# EAGLE design tiller (EAGLE 9.6.2)
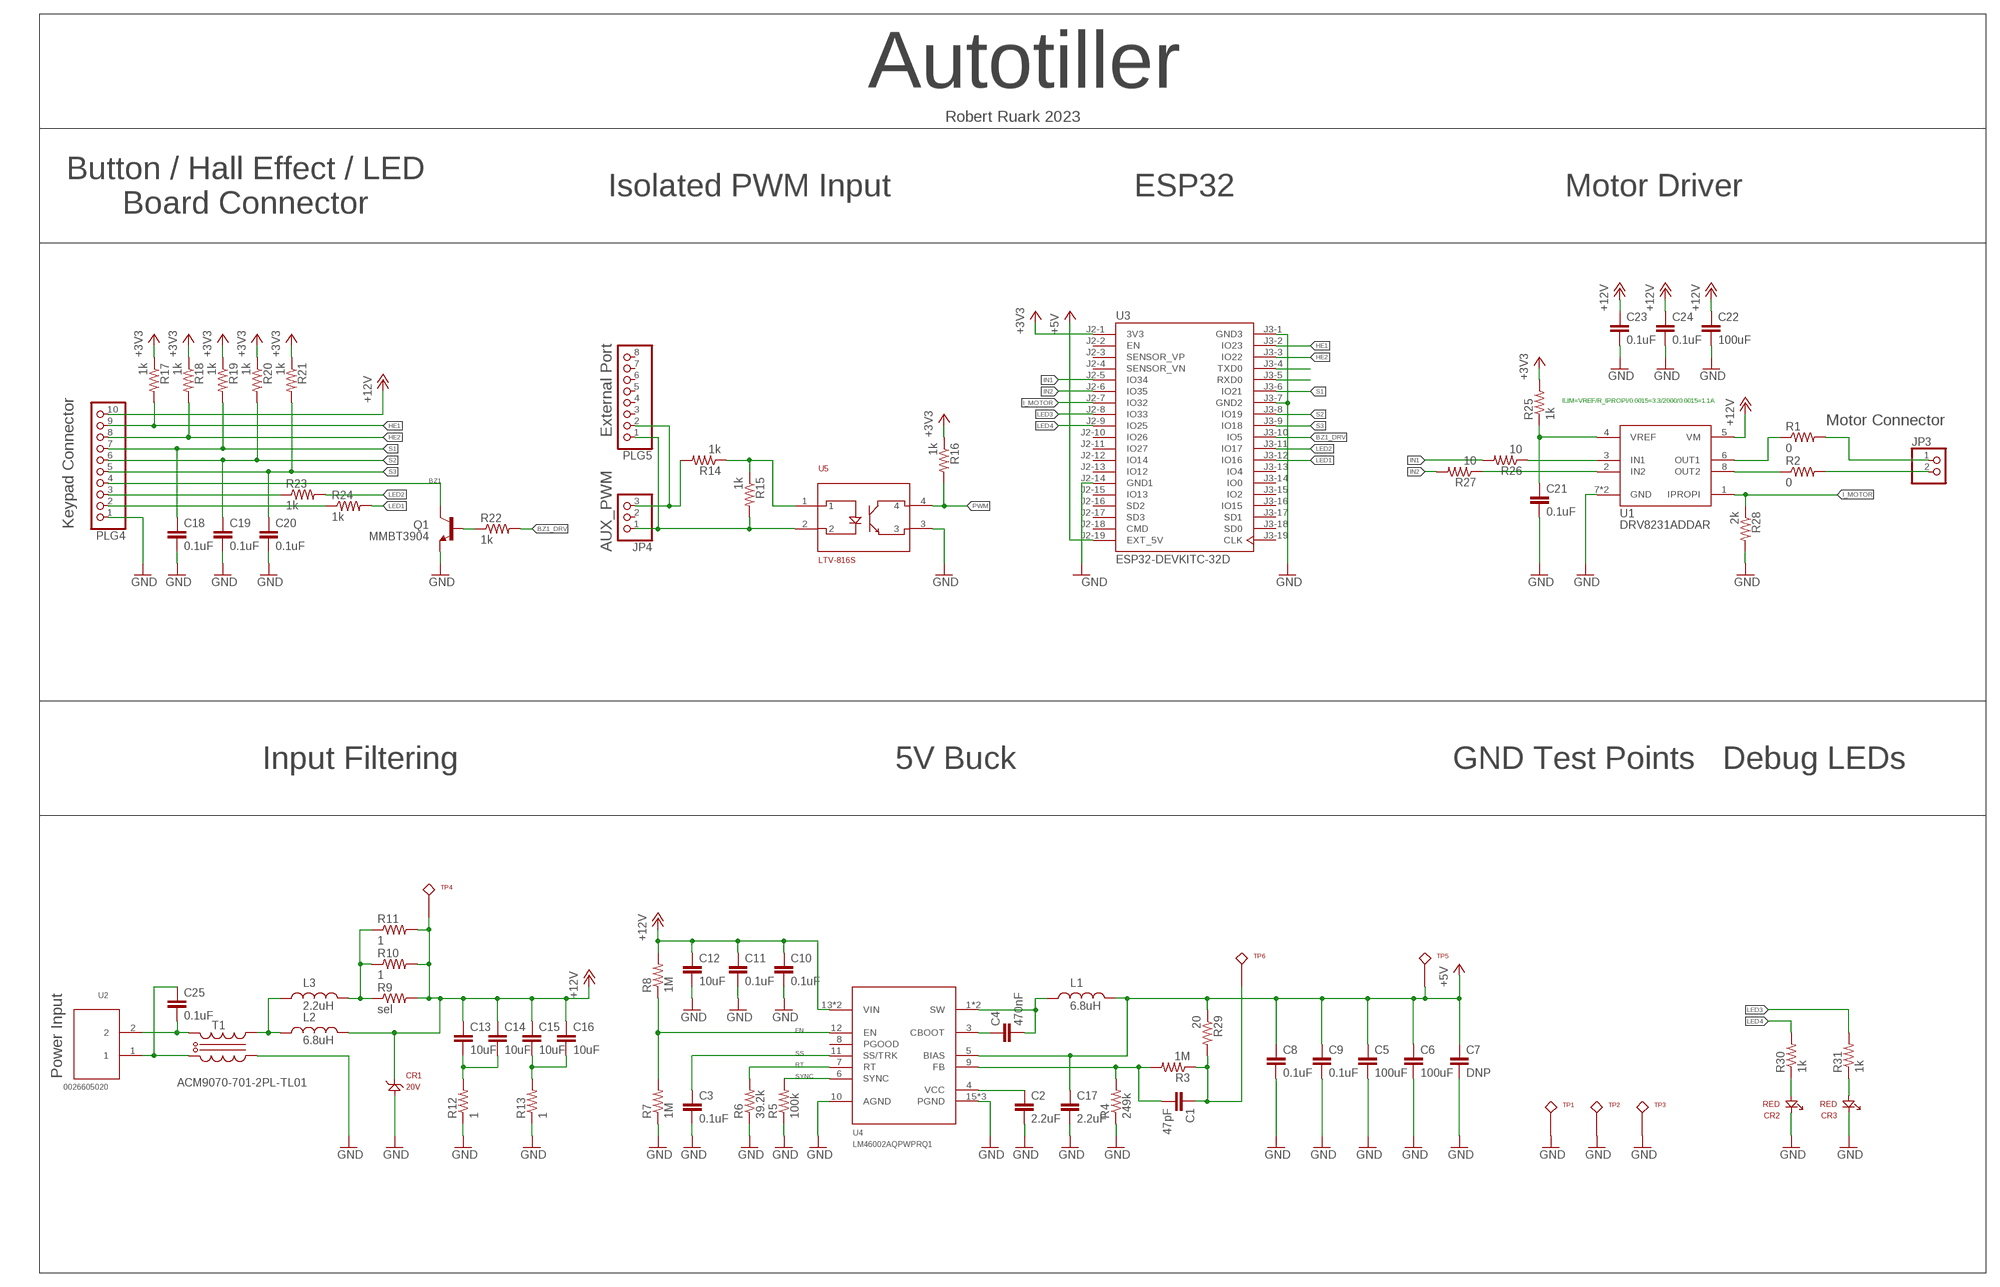
[diagram p0: schematic, sheet 1]

## Parts
C1  47pF  0603_CAPACITOR  [0603]
C2  2.2uF  0805_CAPACITOR  [0805]
C3  0.1uF  0603_CAPACITOR  [0603]
C4  470nF  0805_CAPACITOR  [0805]
C5  100uF  1210_CAPACITOR  [1210]
C6  100uF  1210_CAPACITOR  [1210]
C7  DNP  1210_CAPACITOR  [1210]
C8  0.1uF  0603_CAPACITOR  [0603]
C9  0.1uF  0603_CAPACITOR  [0603]
C10  0.1uF  0603_CAPACITOR  [0603]
C11  0.1uF  0603_CAPACITOR  [0603]
C12  10uF  1210_CAPACITOR  [1210]
C13  10uF  1210_CAPACITOR  [1210]
C14  10uF  1210_CAPACITOR  [1210]
C15  10uF  1210_CAPACITOR  [1210]
C16  10uF  1210_CAPACITOR  [1210]
C17  2.2uF  0805_CAPACITOR  [0805]
C18  0.1uF  0603_CAPACITOR  [0603]
C19  0.1uF  0603_CAPACITOR  [0603]
C20  0.1uF  0603_CAPACITOR  [0603]
C21  0.1uF  0603_CAPACITOR  [0603]
C22  100uF  1210_CAPACITOR  [1210]
C23  0.1uF  0603_CAPACITOR  [0603]
C24  0.1uF  0603_CAPACITOR  [0603]
C25  0.1uF  0603_CAPACITOR  [0603]
CR1  20V  SMAJ20A  [DO-214AC]
CR2  RED  150060RS75000  [0603_DIODE]
CR3  RED  150060RS75000  [0603_DIODE]
JP3  PINHD-1X2/90  [1X02/90]
JP4  PINHD-1X3  [1X03]
L1  6.8uH  NR6020T6R8N  [NR6028]
L2  6.8uH  NR6020T6R8N  [NR6028]
L3  2.2uH  NR6028T2R2N  [NR6028]
PLG4  PINHD-1X10  [1X10]
PLG5  PINHD-1X8  [1X08]
Q1  MMBT3904  MMBT3904-TPCENTERED  [SOT23-3_CENTERED]
R1  0  1206_RESISTOR  [1206]
R2  0  1206_RESISTOR  [1206]
R3  1M  0603_RESISTOR  [0603]
R4  249k  0603_RESISTOR  [0603]
R5  100k  0603_RESISTOR  [0603]
R6  39.2k  0603_RESISTOR  [0603]
R7  1M  0603_RESISTOR  [0603]
R8  1M  0603_RESISTOR  [0603]
R9  sel  1206_RESISTOR  [1206]
R10  1  1206_RESISTOR  [1206]
R11  1  1206_RESISTOR  [1206]
R12  1  1206_RESISTOR  [1206]
R13  1  1206_RESISTOR  [1206]
R14  1k  0603_RESISTOR  [0603]
R15  1k  0603_RESISTOR  [0603]
R16  1k  0603_RESISTOR  [0603]
R17  1k  0603_RESISTOR  [0603]
R18  1k  0603_RESISTOR  [0603]
R19  1k  0603_RESISTOR  [0603]
R20  1k  0603_RESISTOR  [0603]
R21  1k  0603_RESISTOR  [0603]
R22  1k  0603_RESISTOR  [0603]
R23  1k  0603_RESISTOR  [0603]
R24  1k  0603_RESISTOR  [0603]
R25  1k  0603_RESISTOR  [0603]
R26  10  0603_RESISTOR  [0603]
R27  10  0603_RESISTOR  [0603]
R28  2k  0603_RESISTOR  [0603]
R29  20  0603_RESISTOR  [0603]
R30  1k  0603_RESISTOR  [0603]
R31  1k  0603_RESISTOR  [0603]
T1  ACM9070-701-2PL-TL01  [ACM9070]
TP1  5011  [5010]
TP2  5011  [5010]
TP3  5011  [5010]
TP4  5010  [5010]
TP5  5010  [5010]
TP6  5010  [5010]
U1  DRV8231ADDAR  [SOIC8_TP]
U2  0026605020  [3.96MM]
U3  ESP32-DEVKITC-32D  [MODULE_ESP32-DEVKITC-32D]
U4  LM46002AQPWPRQ1  [TSSOP16-POWER]
U5  LTV-816S  [LTV-816S]

## Nets
+3V3: R16.1 R17.1 R18.1 R19.1 R20.1 R21.1 R25.2 U3.J2-1(3V3)
+5V: C5.1 C6.1 C7.1 C8.1 C9.1 C17.1 L1.P$2 R29.1 TP5.P$1 U3.J2-19(EXT_5V) U4.5(BIAS)
+12V: C10.1 C11.1 C12.1 C13.1 C14.1 C15.1 C16.1 C22.1 C23.1 C24.1 CR1.C(K) L2.P$2 PLG4.10 R8.2 R9.2 R10.2 R11.2 TP4.P$1 U1.5(VM) U4.13(VIN) U4.14(VIN)
BST: C4.1 U4.3(CBOOT)
BZ1: PLG4.4 Q1.3(C)
BZ1_DRV: R22.2 U3.J3-10(IO5)
EN: R7.2 R8.1 U4.12(EN)
GND: C2.2 C3.2 C5.2 C6.2 C7.2 C8.2 C9.2 C10.2 C11.2 C12.2 C17.2 C18.2 C19.2 C20.2 C21.2 C22.2 C23.2 C24.2 CR1.A CR2.K CR3.K PLG4.1 Q1.2(E) R4.1 R5.1 R6.1 R7.1 R12.1 R13.1 R28.2 T1.1OUT TP1.P$1 TP2.P$1 TP3.P$1 U1.7(GND) U1.TP(GND) U3.J2-14(GND1) U3.J3-1(GND3) U3.J3-7(GND2) U4.10(AGND) U4.15(PGND) U4.16(PGND) U4.P$1(PGND) U5.3
HE1: PLG4.9 R17.2 U3.J3-2(IO23)
HE2: PLG4.8 R18.2 U3.J3-3(IO22)
I_MOTOR: R28.1 U1.1(IPROPI) U3.J2-7(IO32)
IN1: R26.2 U3.J2-5(IO34)
IN2: R27.2 U3.J2-6(IO35)
LED1: R24.2 U3.J3-12(IO16)
LED2: R23.2 U3.J3-11(IO17)
LED3: R31.2 U3.J2-8(IO33)
LED4: R30.2 U3.J2-9(IO25)
MOTOR_1: JP3.1 R1.2
MOTOR_2: JP3.2 R2.2
N$1: C25.1 T1.1IN U2.1
N$2: C2.1 U4.4(VCC)
N$3: R1.1 U1.6(OUT1)
N$4: R2.1 U1.8(OUT2)
N$5: C1.1 R3.1 R29.2 TP6.P$1
N$6: CR2.A R30.1
N$7: R14.1 R15.1 U5.1
N$8: C1.2 R3.2 R4.2 U4.9(FB)
N$9: PLG4.3 R23.1
N$10: Q1.1(B) R22.1
N$11: U3.J3-4(TXD0)
N$12: U3.J3-5(RXD0)
N$13: C25.2 T1.2IN U2.2
N$14: CR3.A R31.1
N$15: L3.P$2 R9.1 R10.1 R11.1
N$16: C13.2 C14.2 R12.2
N$17: PLG4.2 R24.1
N$18: C21.1 R25.1 U1.4(VREF)
N$19: C15.2 C16.2 R13.2
N$21: R27.1 U1.2(IN2)
N$22: R26.1 U1.3(IN1)
PWM: R16.2 U5.4
PWMIN: JP4.3 PLG5.2 R14.2
RT: R6.2 U4.7(RT)
RTN: JP4.1 PLG5.1 R15.2 U5.2
S1: C18.1 PLG4.7 R19.2 U3.J3-6(IO21)
S2: C19.1 PLG4.6 R20.2 U3.J3-8(IO19)
S3: C20.1 PLG4.5 R21.2 U3.J3-9(IO18)
SS: C3.1 U4.11(SS/TRK)
SW: C4.2 L1.P$1 U4.1(SW) U4.2(SW)
SYNC: R5.2 U4.6(SYNC)
VINF: L2.P$1 L3.P$1 T1.2OUT
Unconnected: JP4.2 PLG5.3 PLG5.4 PLG5.5 PLG5.6 PLG5.7 PLG5.8 U3.J2-2(EN) U3.J2-3(SENSOR_VP) U3.J2-4(SENSOR_VN) U3.J2-10(IO26) U3.J2-11(IO27) U3.J2-12(IO14) U3.J2-13(IO12) U3.J2-15(IO13) U3.J2-16(SD2) U3.J2-17(SD3) U3.J2-18(CMD) U3.J3-13(IO4) U3.J3-14(IO0) U3.J3-15(IO2) U3.J3-16(IO15) U3.J3-17(SD1) U3.J3-18(SD0) U3.J3-19(CLK) U4.8(PGOOD)

## Notes on the sheet
- Autotiller
- Robert Ruark 2023
- Button / Hall Effect / LED
  Board Connector
- Isolated PWM Input | ESP32 | Motor Driver
- ILIM=VREF/R_IPROPI/0.0015=3.3/2000/0.0015=1.1A
- Motor Connector
- External Port
- Keypad Connector
- AUX_PWM
- Input Filtering | 5V Buck | GND Test Points | Debug LEDs
- Power Input

## Library data of the parts
C1 C3 C8-C11 C18-C21 C23-C25 = ruark2:0603_CAPACITOR: 0603 Capacitor -- WARNING: NO DEFINED VALUE OR PART NUMBER; VALUE: sel
C2 C4 C17 = ruark2:0805_CAPACITOR: NO DEFINED PN
C5-C7 C12-C16 C22 = ruark2:1210_CAPACITOR: NO VALUE
CR1 = ruark2:SMAJ20A: 32.4V Clamp 12.3A Ipp Tvs Diode Surface Mount DO-214AC; PARTNO: 732-SMAJ20ACT-ND
CR2 CR3 = ruark2:150060RS75000: Red 625nm LED Indication - Discrete 2V 0603 (1608 Metric); PARTNO: 732-4978-1-ND
JP3 = pinhead:PINHD-1X2: PIN HEADER
JP4 = pinhead:PINHD-1X3: PIN HEADER
L1 L2 = ruark2:NR6020T6R8N: 6.8 µH Shielded Drum Core, Wirewound Inductor 1.8 A 102mOhm Max Nonstandard (Many values available in series); PARTNO: 587-2629-1-ND
L3 = ruark2:NR6028T2R2N: 2.2 µH Shielded Drum Core, Wirewound Inductor 3.7 A 26mOhm Max Nonstandard (Many values available in series); PARTNO: 587-2098-1-ND
PLG4 = pinhead:PINHD-1X10: PIN HEADER
PLG5 = pinhead:PINHD-1X8: PIN HEADER
Q1 = ruark2:MMBT3904-TP: Bipolar (BJT) Transistor NPN 40V 200mA 300MHz 350mW Surface Mount SOT-23 (SMD 2N3904)
R1 R2 R10-R13 = ruark2:1206_RESISTOR: NO DEFINED PN; VALUE: sel
R3-R8 R14-R31 = ruark2:0603_RESISTOR: 0603 Resistor -- WARNING: NO DEFINED PART NUMBER OR VALUE; VALUE: sel
R9 = ruark2:1206_RESISTOR: NO DEFINED PN
T1 = ruark2:ACM9070-701-2PL-TL01: 2 Line Common Mode Choke Surface Mount 700 Ohms @ 100MHz 5A DCR 10mOhm; PARTNO: 445-2216-1-ND
TP1-TP3 = ruark2:5011: Black PC Test Point, Multipurpose Phosphor Bronze, Silver Plating 0.063" (1.60mm) Hole Diameter Mounting Type; PARTNO: 36-5011-ND
TP4-TP6 = ruark2:5010: Red PC Test Point, Multipurpose Phosphor Bronze, Silver Plating 0.063" (1.60mm) Hole Diameter Mounting Type; PARTNO: 36-5010-ND
U1 = ruark2:DRV8231ADDAR: 33V, 3.7A, Bipolar Motor Driver NMOS PWM 8-SO PowerPad 2 H-BRIDGE; PARTNO: 296-DRV8231ADDARCT-ND
U2 = ruark2:0026605020: Connector Header Through Hole, Right Angle 2 position 0.156" (3.96mm); PARTNO: WM4640-ND
U3 = ESP32-DEVKITC-32D:ESP32-DEVKITC-32D: Check availability <https://pricing.snapeda.com/parts/ESP32-DEVKITC-32D/Espressif%20Systems/view-part?ref=eda>; AVAILABILITY: In Stock; DESCRIPTION: WiFi Development Tools (802.11) ESP32 General Development Kit, ESP32-WROOM-32D on the board; MF: Espressif Systems; MP: ESP32-DEVKITC-32D; PACKAGE: None; PRICE: None; PURCHASE-URL: https://pricing.snapeda.com/search/part/ESP32-DEVKITC-32D/?ref=eda
U4 = ruark2:LM46002AQPWPRQ1: Buck Switching Regulator IC Positive Adjustable 1V 1 Output 2A 16-TSSOP (0.173", 4.40mm Width) Exposed Pad 60V; PARTNO: 296-48923-1-ND
U5 = ruark2:LTV-816S: Optoisolator Transistor Output 5000Vrms 1 Channel 4-SMD; PARTNO: 160-1892-1-ND

## Board
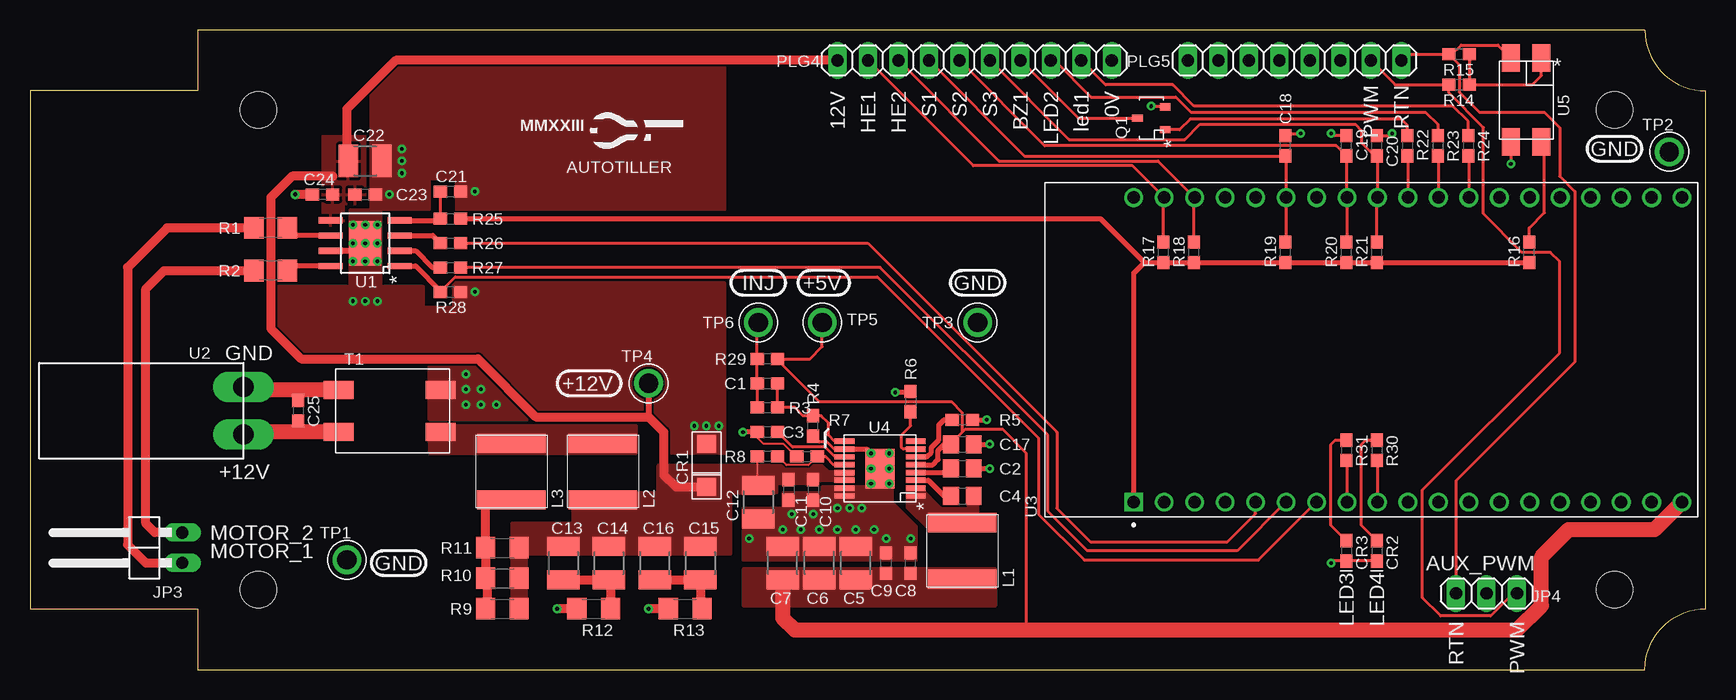
[diagram p1: board, top side]
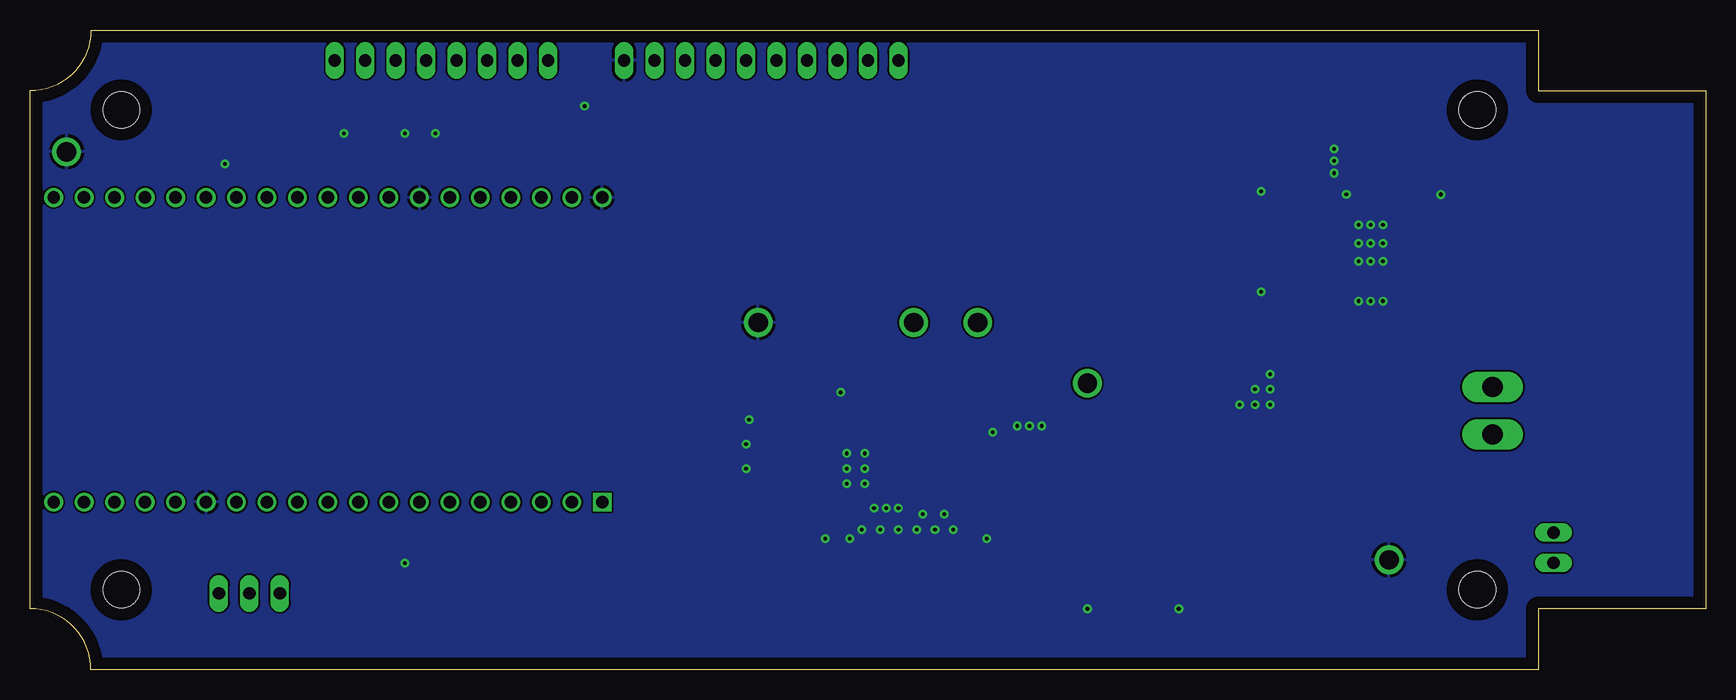
[diagram p2: board, bottom side, seen from below]

Size 139.7 x 53.34 mm. Coordinates in mm from the lower left corner, seen from the top.
Outline: 0,5.08 13.97,5.08 13.97,0 134.62,0 arc-90 139.7,5.08 139.7,48.26 arc-90 134.62,53.34 13.97,53.34 13.97,48.26 0,48.26 0,5.08
Copper layers (1*16): Top 0.035mm / dielectric 1.5mm / Bottom 0.035mm
Design rules "default *": minimum track width 6mil, minimum drill 12mil, track to track 6mil, track to pad 6mil, pad to pad 6mil, via to via 6mil, smd to smd 6mil, copper to edge 40mil, drill to drill 6mil, minimum pad ring 10mil, minimum via ring 8mil, stop-mask expansion 4mil, vias tented up to drill 0mil, thermal gap 10mil
Holes 3.05 mm at 19.05,46.67 19.05,6.67 132.08,46.67 132.08,6.67

### Footprints (pad centres in the part's own frame; a part is rotated, then mirrored left to right if it is on the bottom)
0603 = smd 1.1 x 1: 1 -0.85,0; 2 0.85,0
0805 = smd 1.3 x 1.5: 1 -0.95,0; 2 0.95,0
1210 = smd 1.6 x 2.7: 1 -1.4,0; 2 1.4,0
DO-214AC = smd 1.5 x 1.6: A -1.8,0; C 1.8,0
0603_DIODE = smd 1.1 x 1: A -0.85,0; K 0.85,0
1X02/90 = drill 1.016 long: 1 -1.27,-3.81; 2 1.27,-3.81
1X03 = drill 1.016 long: 1 -2.54,0; 2 0,0; 3 2.54,0
NR6028 = smd 1.6 x 5.7: P$1 2.35,0; P$2 -2.35,0
1X10 = drill 1.016 long: 1 -11.43,0; 2 -8.89,0; 3 -6.35,0; 4 -3.81,0; 5 -1.27,0; 6 1.27,0; 7 3.81,0; 8 6.35,0; 9 8.89,0; 10 11.43,0
1X08 = drill 1.016 long: 1 -8.89,0; 2 -6.35,0; 3 -3.81,0; 4 -1.27,0; 5 1.27,0; 6 3.81,0; 7 6.35,0; 8 8.89,0
SOT23-3_CENTERED = smd 0.6 x 0.9: 1 -0.95,-1.15; 2 0.95,-1.15; 3 0,1.15
1206 = smd 1.6 x 1.8: 1 -1.4,0; 2 1.4,0
ACM9070 = smd 2.5 x 1.5: 1IN -4.25,1.75; 1OUT 4.25,1.75; 2IN -4.25,-1.75; 2OUT 4.25,-1.75
5010 = drill 1.6: P$1 0,0
SOIC8_TP = smd 1.981 x 0.533: 1 -2.87,1.905; 2 -2.87,0.635; 3 -2.87,-0.635; 4 -2.87,-1.905; 5 2.87,-1.905; 6 2.87,-0.635; 7 2.87,0.635; 8 2.87,1.905 | smd 2.7 x 3.7: TP 0,0
3.96MM = drill 1.7 long: 1 1.98,0; 2 -1.98,0
MODULE_ESP32-DEVKITC-32D = drill 1.04 square: J2-1 -12.7,19.76 | drill 1.04: J2-2 -12.7,17.22; J2-3 -12.7,14.68; J2-4 -12.7,12.14; J2-5 -12.7,9.6; J2-6 -12.7,7.06; J2-7 -12.7,4.52; J2-8 -12.7,1.98; J2-9 -12.7,-0.56; J2-10 -12.7,-3.1; J2-11 -12.7,-5.64; J2-12 -12.7,-8.18; J2-13 -12.7,-10.72; J2-14 -12.7,-13.26; J2-15 -12.7,-15.8; J2-16 -12.7,-18.34; J2-17 -12.7,-20.88; J2-18 -12.7,-23.42; J2-19 -12.7,-25.96; J3-1 12.7,19.76; J3-2 12.7,17.22; J3-3 12.7,14.68; J3-4 12.7,12.14; J3-5 12.7,9.6; J3-6 12.7,7.06; J3-7 12.7,4.52; J3-8 12.7,1.98; J3-9 12.7,-0.56; J3-10 12.7,-3.1; J3-11 12.7,-5.64; J3-12 12.7,-8.18; J3-13 12.7,-10.72; J3-14 12.7,-13.26; J3-15 12.7,-15.8; J3-16 12.7,-18.34; J3-17 12.7,-20.88; J3-18 12.7,-23.42; J3-19 12.7,-25.96
TSSOP16-POWER = smd 0.45 x 1.65: 1 -2.275,-2.975; 2 -1.625,-2.975; 3 -0.975,-2.975; 4 -0.325,-2.975; 5 0.325,-2.975; 6 0.975,-2.975; 7 1.625,-2.975; 8 2.275,-2.975; 9 2.275,2.975; 10 1.625,2.975; 11 0.975,2.975; 12 0.325,2.975; 13 -0.325,2.975; 14 -0.975,2.975; 15 -1.625,2.975; 16 -2.275,2.975 | smd 3.29 x 2.41: P$1 0,0
LTV-816S = smd 1.5 x 2.3: 1 -1.27,-3.5; 2 1.27,-3.5; 3 1.27,3.5; 4 -1.27,3.5

### Placement (x,y rotation side)
C1  61.47,23.88 0 top
C2  77.72,16.76 0 top
C3  61.47,19.81 180 top
C4  77.72,14.48 0 top
C5  68.83,8.89 90 top
C6  65.79,8.89 90 top
C7  62.74,8.89 90 top
C8  73.41,8.89 90 top
C9  71.37,8.89 90 top
C10  65.28,14.99 270 top
C11  63.25,14.99 270 top
C12  60.71,13.97 270 top
C13  44.45,8.89 270 top
C14  48.26,8.89 270 top
C15  55.88,8.89 270 top
C16  52.07,8.89 270 top
C17  77.72,18.8 0 top
C18  104.65,43.69 90 top
C19  109.73,43.69 90 top
C20  112.27,43.69 90 top
C21  35.05,39.88 0 top
C22  27.94,42.42 0 top
C23  27.94,39.62 0 top
C24  24.38,39.62 180 top
C25  22.35,21.59 270 top
CR1  56.39,17.02 270 top
CR2  112.27,9.91 270 top
CR3  109.73,9.91 270 top
JP3  8.89,10.16 90 top
JP4  121.41,6.35 0 top
L1  77.72,9.91 90 top
L2  47.75,16.51 90 top
L3  40.13,16.51 90 top
PLG4  78.74,50.8 180 top
PLG5  105.41,50.8 180 top
Q1  93.47,45.97 90 top
R1  20.07,36.83 180 top
R2  20.07,33.27 180 top
R3  61.47,21.84 0 top
R4  65.28,20.32 90 top
R5  77.72,20.83 180 top
R6  73.41,22.35 270 top
R7  64.77,17.78 0 top
R8  61.47,17.78 180 top
R9  39.37,5.08 0 top
R10  39.37,7.62 0 top
R11  39.37,10.16 0 top
R12  46.99,5.08 0 top
R13  54.61,5.08 0 top
R14  119.13,48.77 180 top
R15  119.13,51.31 180 top
R16  124.97,34.8 90 top
R17  94.49,34.8 90 top
R18  97.03,34.8 90 top
R19  104.65,34.8 90 top
R20  109.73,34.8 90 top
R21  112.27,34.8 90 top
R22  114.81,43.69 270 top
R23  117.35,43.69 270 top
R24  119.89,43.69 270 top
R25  35.05,37.59 0 top
R26  35.05,35.56 0 top
R27  35.05,33.53 0 top
R28  35.05,31.5 0 top
R29  61.47,25.91 180 top
R30  112.27,18.29 270 top
R31  109.73,18.29 270 top
T1  29.97,21.59 0 top
TP1  26.42,9.14 0 top
TP2  136.65,43.18 0 top
TP3  78.99,28.96 0 top
TP4  51.56,23.88 0 top
TP5  66.04,28.96 0 top
TP6  60.71,28.96 0 top
U1  27.94,35.56 180 top
U2  17.78,21.59 90 top
U3  111.76,26.67 90 top
U4  70.87,16.76 90 top
U5  124.71,47.5 180 top

### Tracks (layer width: path | path; a pad name or v marks a point on that pad's centre or on a via)
+3V3
  Top 0.406: U3.J2-1 92,33.07 92.88,33.95 | 92.88,33.95 R17.1 R18.1 R19.1 R20.1 R21.1 R16.1 | R25.2 89.23,37.59 92.88,33.95
+5V
  Top 0.254: 83.06,3.3 83.06,18.03 81.04,20.05 77.96,20.05 77.72,19.81 | 77.72,19.81 76.71,18.8 | 77.72,19.81 77.72,21.42 76.8,22.35 65.79,22.35 62.32,25.82 R29.1 65.02,25.91 66.04,26.92 TP5.P$1
  Top 0.406: U4.5 75.25,17.09 75.69,17.53 75.69,18.29 76.2,18.8 76.71,18.8 C17.1
  Top 1.27: C7.1 62.74,4.32 63.75,3.3 83.06,3.3 123.95,3.3 125.98,5.33 125.98,9.4 128.27,11.68 135.43,11.68 U3.J2-19
  pour Top (no thermals): 80.52,8.38 59.44,8.38 59.44,5.33 80.52,5.33
+12V
  Top 0.152: R8.2 60.62,15.46 C12.1
  Top 0.508: TP4.P$1 51.56,21.08
  Top 0.762: 25.27,41.15 21.84,41.15 20.07,39.37 20.07,28.45 22.61,25.91 37.34,25.91 42.16,21.08 51.56,21.08 52.83,19.81 52.83,16.26 53.87,15.22 CR1.C | PLG4.10 30.48,50.8 26.42,46.74 26.42,42.54 C22.1
  pour Top (no thermals): 68.58,15.75 65.53,15.75 65.53,15.49 62.23,15.49 62.23,14.73 58.93,14.73 58.93,17.02 66.04,17.02 66.55,16.51 68.58,16.51
  pour Top (no thermals): 40.13,4.32 41.4,4.32 41.4,9.65 58.42,9.65 58.42,14.73 61.72,14.73 61.72,17.02 52.32,17.02 52.32,14.73 45.21,14.73 45.21,12.19 40.13,12.19
  pour Top: 26.16,37.08 26.16,38.86 27.94,38.86 27.94,44.45 24.38,44.45 24.38,37.08
BST
  Top 0.406: U4.3 74.89,15.79 76.2,14.48 C4.1
BZ1
  Top 0.254: PLG4.4 87.38,45.97 Q1.3
BZ1_DRV
  Top 0.254: R22.2 114.86,42.79 U3.J3-10
EN
  Top 0.152: R7.2 64.89,17.05 63.05,17.05 R8.1
  Top 0.254: U4.12 66.98,17.09 66.29,17.78 R7.2
GND  (via drill 0.3, 0.35)
  Top 0.152: R7.1 63.5,18.2 63.42,18.2 62.8,18.83 61.16,18.83 60.62,19.38 C3.2
  Top 0.254: R4.1 65.78,18.97 66.45,18.97 67.03,18.39 U4.10 | U5.3 v123.44,42.16 | Q1.2 93.54,46.92 v93.47,46.99 | C18.2 104.81,44.7 v105.92,44.7 | C19.2 108.62,44.54 v108.46,44.7 | C20.2 113.37,44.54 v113.54,44.7 | v108.46,8.89 108.62,9.06 CR3.K CR2.K
  Top 0.406: U4.10 69.75,18.39 70.87,17.27 U4.P$1 | C2.2 v80.01,16.76 | C17.2 v80.01,18.8 | R5.1 v79.76,20.83 | R6.1 73.32,23.11 v72.14,23.11 | C3.2 v59.44,19.81
  Top 0.508: U1.7 27.05,34.92 27.18,35.05 27.18,35.31 v26.92,35.56
  Top 0.762: R13.1 v51.56,5.08 | R12.1 v43.94,5.08 | C24.2 v22.1,39.62
  other vias: 71.63,18.03 70.1,18.03 71.63,16.76 71.63,15.49 70.1,15.49 70.1,16.76 67.31,13.46 68.33,13.46 69.34,13.46 65.28,12.95 63.5,12.95 59.94,10.92 62.74,11.68 65.79,11.68 68.83,11.68 67.31,11.68 64.26,11.68 70.36,11.68 71.37,10.92 73.41,10.92 26.92,37.08 27.94,37.08 28.96,37.08 27.94,35.56 28.96,35.56 28.96,34.04 27.94,34.04 26.92,34.04 28.96,30.73 27.94,30.73 26.92,30.73 29.97,39.62 30.99,43.43 30.99,42.42 30.99,41.4 37.08,39.88 37.08,31.5 56.39,20.32 55.37,20.32 57.4,20.32 36.32,24.64 36.32,23.37 36.32,22.1 37.59,22.1 37.59,23.37 38.86,22.1
  pour Top (no thermals): 73.91,9.14 73.91,11.94 71.91,13.94 71.91,18.26 70,18.26 69.85,15.24 66.04,15.24 66.04,14.73 62.74,14.73 62.74,13.46 59.44,13.46 59.44,9.14
  pour Top (no thermals): 26.67,32 26.67,38.35 28.45,38.35 28.45,51.82 57.91,51.82 57.91,38.35 35.56,38.35 35.56,40.89 33.27,40.89 33.27,38.35 29.21,38.35 29.21,32 32.77,32 32.77,30.23 35.31,30.23 35.31,32.26 57.91,32.26 57.91,18.03 51.31,18.03 51.31,20.83 33.27,20.83 33.27,25.4 10.67,25.4 10.67,30.99 11.68,32
  pour Bottom: 0,48.26 13.97,48.26 13.97,53.34 134.62,53.34 139.7,48.26 139.7,47.75 139.7,5.08 134.62,0 13.97,0 13.97,5.08 0,5.08
HE1
  Top 0.254: U3.J3-2 94.49,39.42 | PLG4.9 78.64,42.01 91.9,42.01 94.39,39.52 94.49,39.42 | R17.2 94.49,39.42
HE2
  Top 0.254: PLG4.8 80.77,42.42 94.03,42.42 U3.J3-3 97.03,39.32 R18.2
I_MOTOR
  Top 0.254: R28.1 35.45,32.75 70.63,32.75 84.07,19.3 84.07,12.95 87.88,9.14 102.41,9.14 U3.J2-7
  Top 0.406: U1.1 32.13,33.66 34.2,31.58 R28.1
IN1
  Top 0.254: R26.2 69.85,35.56 85.6,19.81 85.6,13.46 88.39,10.67 99.82,10.67 102.16,13.01 U3.J2-5
IN2
  Top 0.254: U3.J2-6 100.64,9.91 88.14,9.91 84.84,13.21 84.84,19.56 70.87,33.53 R27.2
LED1
  Top 0.254: R24.2 119.94,42.79 U3.J3-12
LED2
  Top 0.254: R23.2 117.4,42.79 U3.J3-11
LED3
  Top 0.254: R31.2 109.78,17.39 U3.J2-8
LED4
  Top 0.254: R30.2 112.32,17.39 U3.J2-9
MOTOR_1
  Top 0.762: R1.2 11.43,36.83 8.13,33.53 8.13,10.41 9.65,8.89 JP3.1
MOTOR_2
  Top 0.762: JP3.2 10.41,11.43 9.65,12.19 9.65,31.75 11.18,33.27 R2.2
N$1
  Top 0.279: C25.1 22.35,23.34
  Top 1.27: T1.1IN 22.35,23.34 18.01,23.34 U2.1
N$2
  Top 0.406: U4.4 76.45,16.44 C2.1
N$3
  Top 0.406: U1.6 22.1,36.2 R1.1
N$4
  Top 0.406: U1.8 21.85,33.66 R2.1
N$5
  Top 0.254: R3.1 C1.1 R29.2 60.62,28.87 TP6.P$1
N$6
  Top 0.254: CR2.A 111,12.03 111,18.8 111.34,19.14 R30.1
N$7
  Top 0.254: R15.1 R14.1 125.22,48.77 125.98,49.53 U5.1
N$8
  Top 0.254: U4.9 67.07,19.04 66.55,19.56 66.55,20.57 65.95,21.17 R4.2 64.43,21.17 63.75,21.84 R3.2 C1.2
N$9
  Top 0.254: PLG4.3 85.39,50.8 88.44,47.75 95.5,47.75 96.77,46.48 116.33,46.48 117.35,45.47 R23.1
N$10
  Top 0.254: R22.1 114.81,45.41 114.3,45.92 96.72,45.92 95.82,45.02 Q1.1
N$13
  Top 0.279: C25.2 22.61,20.49 22.61,19.84
  Top 1.27: T1.2IN 22.61,19.84 18.01,19.84 U2.2
N$14
  Top 0.254: CR3.A 108.46,12.03 108.46,18.8 108.8,19.14 R31.1
N$15
  Top 0.762: L3.P$2 40.07,14.22 38.1,14.22 37.97,14.09 R11.1 R10.1 38.1,7.49 38.1,4.57 37.97,4.7 R9.1
N$16
  Top 0.762: C13.2 C14.2 48.39,7.36 R12.2
N$17
  Top 0.254: R24.1 119.89,45.72 118.62,46.99 97.03,46.99 95.25,48.77 89.66,48.77 PLG4.2
N$18
  Top 0.254: C21.1 R25.1
  Top 0.406: U1.4 34.08,37.47 R25.1
N$19
  Top 0.762: C16.2 C15.2 55.88,4.57 56.01,4.7 R13.2
N$21
  Top 0.406: U1.2 32.13,34.92 33.53,33.53 R27.1
N$22
  Top 0.406: U1.3 33.57,36.2 R26.1
PWM
  Top 0.254: R16.2 124.97,36.83 126.24,38.1 126.24,43.74 U5.4
PWMIN
  Top 0.254: PLG5.2 113.79,48.77 R14.2 118.28,48.09 121.16,45.21 121.16,38.01 124.37,34.8 126.75,34.8 127.51,34.04 127.51,26.42 116.08,14.99 116.08,5.99 117.6,4.47 121.77,4.47 123.65,6.35 JP4.3
RT
  Top 0.254: U4.7 72.8,18.39 72.64,18.54 72.64,19.56 73.41,20.32 R6.2
RTN
  Top 0.254: PLG5.1 114.81,51.31 R15.2 | R15.2 118.53,51.31 119.31,52.09 122.36,52.09 U5.2 | R15.2 119.13,50.46 119.13,48.17 120.82,46.48 126.24,46.48 127.51,45.21 127.51,41.15 128.78,39.88 128.78,25.65 118.87,15.75 JP4.1
S1
  Top 0.254: PLG4.7 82.89,42.84 C18.1 104.7,42.79 U3.J3-6 104.7,35.7 R19.2
S2
  Top 0.254: PLG4.6 84.58,43.69 108.88,43.69 C19.1 109.78,42.79 U3.J3-8 109.78,35.7 R20.2
S3
  Top 0.254: PLG4.5 86.61,44.2 96.27,44.2 97.54,45.47 110.49,45.47 111,44.96 111,43.94 112.1,42.84 C20.1 112.32,42.79 U3.J3-9 112.27,39.32 R21.2
SS
  Top 0.254: U4.11 67.1,17.74 66.45,18.39 66.45,18.4 66.29,18.56 63.57,18.56 C3.1
SW
  pour Top (no thermals): 73.15,15.24 74.17,15.24 75.95,13.46 78.23,13.46 78.23,14.99 78.99,14.99 78.99,12.95 80.26,12.95 80.26,11.68 74.93,11.68 73.15,13.46
SYNC
  Top 0.406: U4.6 74.74,17.74 75.13,18.13 75.13,18.52 75.77,19.16 75.77,20.4 76.2,20.83 R5.2
VINF
  pour Top (no thermals): 33.27,20.32 33.27,18.03 50.55,18.03 50.55,20.32

### Text on the board
tPlace: PWM | RTN | 12V | HE1 | HE2 | S1 | S2 | S3 | BZ1 | LED2 | led1 | 0V | MMXXIII | GND | AUTOTILLER | INJ | +5V | GND | GND | +12V | +12V | MOTOR_2 | MOTOR_1 | GND | AUX_PWM | LED3 | LED4 | RTN | PWM
tStop: 033